# EAGLE design CY8C_TQFP_BreakOut (EAGLE 6.5.0)
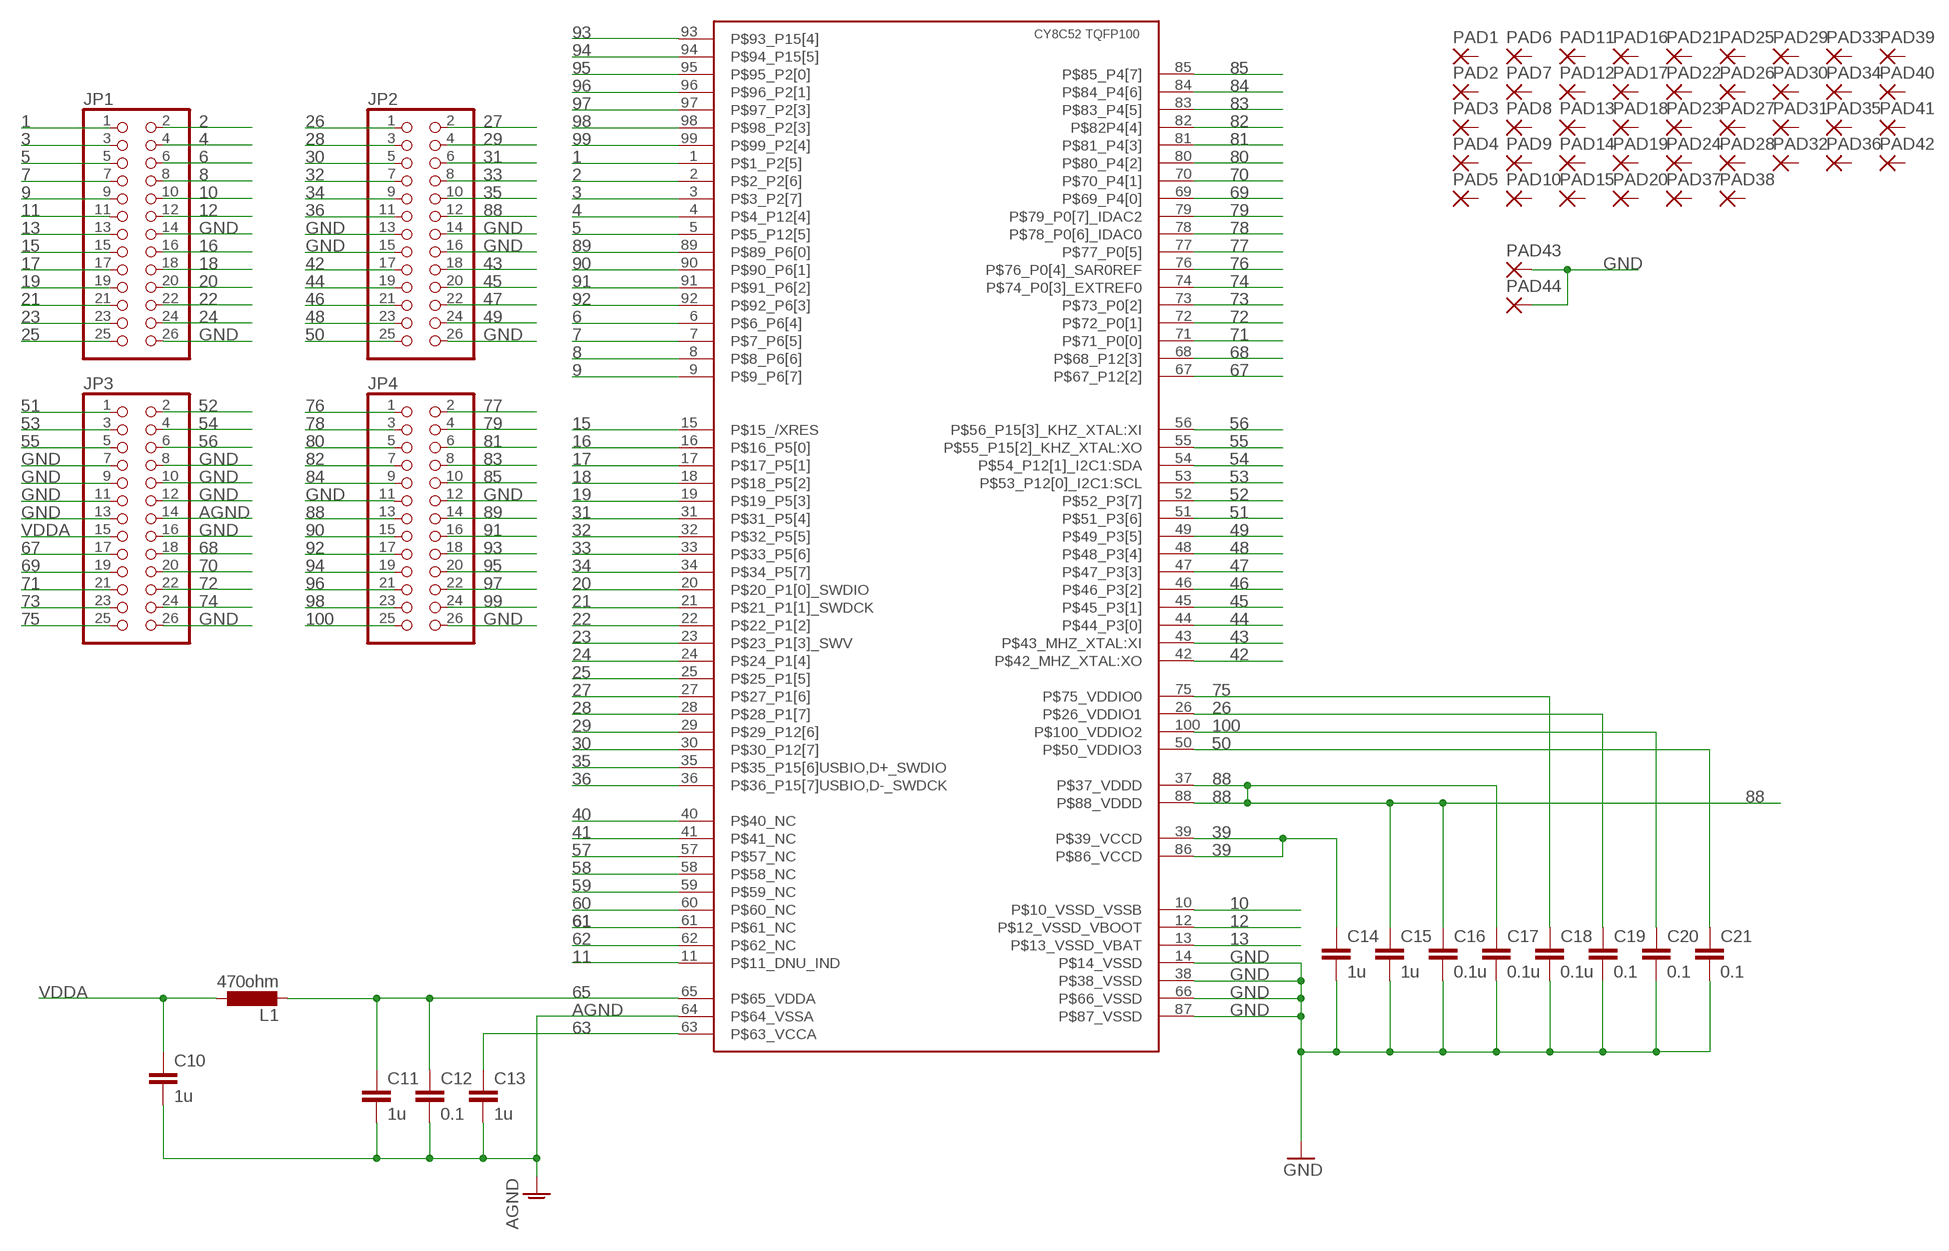
[diagram p0: schematic, sheet 1]

## Parts
C10  1u  C-EUC3216  [C3216]
C11  1u  C-EUC3216  [C3216]
C12  0.1  C-EUC2012  [C2012]
C13  1u  C-EUC2012  [C2012]
C14  1u  C-EUC3216  [C3216]
C15  1u  C-EUC3216  [C3216]
C16  0.1u  C-EUC2012  [C2012]
C17  0.1u  C-EUC2012  [C2012]
C18  0.1u  C-EUC2012  [C2012]
C19  0.1  C-EUC2012  [C2012]
C20  0.1  C-EUC2012  [C2012]
C21  0.1  C-EUC2012  [C2012]
IC1  PSOC5LP52XX_TQFP100  [TQFP100_MOD]
JP1  PINHD-2X13  [2X13]
JP2  PINHD-2X13  [2X13]
JP3  PINHD-2X13  [2X13]
JP4  PINHD-2X13  [2X13]
L1  470ohm  L-EUL3225M  [L3225M]
PAD1  SMD2  [SMD1,27-2,54]
PAD2  SMD2  [SMD1,27-2,54]
PAD3  SMD2  [SMD1,27-2,54]
PAD4  SMD2  [SMD1,27-2,54]
PAD5  SMD2  [SMD1,27-2,54]
PAD6  SMD2  [SMD1,27-2,54]
PAD7  SMD2  [SMD1,27-2,54]
PAD8  SMD2  [SMD1,27-2,54]
PAD9  SMD2  [SMD1,27-2,54]
PAD10  SMD2  [SMD1,27-2,54]
PAD11  SMD2  [SMD1,27-2,54]
PAD12  SMD2  [SMD1,27-2,54]
PAD13  SMD2  [SMD1,27-2,54]
PAD14  SMD2  [SMD1,27-2,54]
PAD15  SMD2  [SMD1,27-2,54]
PAD16  SMD2  [SMD1,27-2,54]
PAD17  SMD2  [SMD1,27-2,54]
PAD18  SMD2  [SMD1,27-2,54]
PAD19  SMD2  [SMD1,27-2,54]
PAD20  SMD2  [SMD1,27-2,54]
PAD21  SMD2  [SMD1,27-2,54]
PAD22  SMD2  [SMD1,27-2,54]
PAD23  SMD2  [SMD1,27-2,54]
PAD24  SMD2  [SMD1,27-2,54]
PAD25  SMD2  [SMD1,27-2,54]
PAD26  SMD2  [SMD1,27-2,54]
PAD27  SMD2  [SMD1,27-2,54]
PAD28  SMD2  [SMD1,27-2,54]
PAD29  SMD2  [SMD1,27-2,54]
PAD30  SMD2  [SMD1,27-2,54]
PAD31  SMD2  [SMD1,27-2,54]
PAD32  SMD2  [SMD1,27-2,54]
PAD33  SMD2  [SMD1,27-2,54]
PAD34  SMD2  [SMD1,27-2,54]
PAD35  SMD2  [SMD1,27-2,54]
PAD36  SMD2  [SMD1,27-2,54]
PAD37  SMD2  [SMD1,27-2,54]
PAD38  SMD2  [SMD1,27-2,54]
PAD39  SMD2  [SMD1,27-2,54]
PAD40  SMD2  [SMD1,27-2,54]
PAD41  SMD2  [SMD1,27-2,54]
PAD42  SMD2  [SMD1,27-2,54]
PAD43  SMD2  [SMD1,27-2,54]
PAD44  SMD2  [SMD1,27-2,54]

## Nets
1: IC1.1(P$1_P2[5]) JP1.1
2: IC1.2(P$2_P2[6]) JP1.2
3: IC1.3(P$3_P2[7]) JP1.3
4: IC1.4(P$4_P12[4]) JP1.4
5: IC1.5(P$5_P12[5]) JP1.5
6: IC1.6(P$6_P6[4]) JP1.6
7: IC1.7(P$7_P6[5]) JP1.7
8: IC1.8(P$8_P6[6]) JP1.8
9: IC1.9(P$9_P6[7]) JP1.9
10: IC1.10(P$10_VSSD_VSSB) JP1.10
11: IC1.11(P$11_DNU_IND) JP1.11
12: IC1.12(P$12_VSSD_VBOOT) JP1.12
13: IC1.13(P$13_VSSD_VBAT) JP1.13
15: IC1.15(P$15_/XRES) JP1.15
16: IC1.16(P$16_P5[0]) JP1.16
17: IC1.17(P$17_P5[1]) JP1.17
18: IC1.18(P$18_P5[2]) JP1.18
19: IC1.19(P$19_P5[3]) JP1.19
20: IC1.20(P$20_P1[0]_SWDIO) JP1.20
21: IC1.21(P$21_P1[1]_SWDCK) JP1.21
22: IC1.22(P$22_P1[2]) JP1.22
23: IC1.23(P$23_P1[3]_SWV) JP1.23
24: IC1.24(P$24_P1[4]) JP1.24
25: IC1.25(P$25_P1[5]) JP1.25
26: C19.1 IC1.26(P$26_VDDIO1) JP2.1
27: IC1.27(P$27_P1[6]) JP2.2
28: IC1.28(P$28_P1[7]) JP2.3
29: IC1.29(P$29_P12[6]) JP2.4
30: IC1.30(P$30_P12[7]) JP2.5
31: IC1.31(P$31_P5[4]) JP2.6
32: IC1.32(P$32_P5[5]) JP2.7
33: IC1.33(P$33_P5[6]) JP2.8
34: IC1.34(P$34_P5[7]) JP2.9
35: IC1.35(P$35_P15[6]USBIO,D+_SWDIO) JP2.10
36: IC1.36(P$36_P15[7]USBIO,D-_SWDCK) JP2.11
39: C14.1 IC1.39(P$39_VCCD) IC1.86(P$86_VCCD)
40: IC1.40(P$40_NC)
41: IC1.41(P$41_NC)
42: IC1.42(P$42_MHZ_XTAL:XO) JP2.17
43: IC1.43(P$43_MHZ_XTAL:XI) JP2.18
44: IC1.44(P$44_P3[0]) JP2.19
45: IC1.45(P$45_P3[1]) JP2.20
46: IC1.46(P$46_P3[2]) JP2.21
47: IC1.47(P$47_P3[3]) JP2.22
48: IC1.48(P$48_P3[4]) JP2.23
49: IC1.49(P$49_P3[5]) JP2.24
50: C21.1 IC1.50(P$50_VDDIO3) JP2.25
51: IC1.51(P$51_P3[6]) JP3.1
52: IC1.52(P$52_P3[7]) JP3.2
53: IC1.53(P$53_P12[0]_I2C1:SCL) JP3.3
54: IC1.54(P$54_P12[1]_I2C1:SDA) JP3.4
55: IC1.55(P$55_P15[2]_KHZ_XTAL:XO) JP3.5
56: IC1.56(P$56_P15[3]_KHZ_XTAL:XI) JP3.6
57: IC1.57(P$57_NC)
58: IC1.58(P$58_NC)
59: IC1.59(P$59_NC)
60: IC1.60(P$60_NC)
61: IC1.61(P$61_NC)
62: IC1.62(P$62_NC)
63: C13.1 IC1.63(P$63_VCCA)
65: C11.1 C12.1 IC1.65(P$65_VDDA) L1.2
67: IC1.67(P$67_P12[2]) JP3.17
68: IC1.68(P$68_P12[3]) JP3.18
69: IC1.69(P$69_P4[0]) JP3.19
70: IC1.70(P$70_P4[1]) JP3.20
71: IC1.71(P$71_P0[0]) JP3.21
72: IC1.72(P$72_P0[1]) JP3.22
73: IC1.73(P$73_P0[2]) JP3.23
74: IC1.74(P$74_P0[3]_EXTREF0) JP3.24
75: C18.1 IC1.75(P$75_VDDIO0) JP3.25
76: IC1.76(P$76_P0[4]_SAR0REF) JP4.1
77: IC1.77(P$77_P0[5]) JP4.2
78: IC1.78(P$78_P0[6]_IDAC0) JP4.3
79: IC1.79(P$79_P0[7]_IDAC2) JP4.4
80: IC1.80(P$80_P4[2]) JP4.5
81: IC1.81(P$81_P4[3]) JP4.6
82: IC1.82(P$82P4[4]) JP4.7
83: IC1.83(P$83_P4[5]) JP4.8
84: IC1.84(P$84_P4[6]) JP4.9
85: IC1.85(P$85_P4[7]) JP4.10
88: C15.1 C16.1 C17.1 IC1.37(P$37_VDDD) IC1.88(P$88_VDDD) JP2.12 JP4.13
89: IC1.89(P$89_P6[0]) JP4.14
90: IC1.90(P$90_P6[1]) JP4.15
91: IC1.91(P$91_P6[2]) JP4.16
92: IC1.92(P$92_P6[3]) JP4.17
93: IC1.93(P$93_P15[4]) JP4.18
94: IC1.94(P$94_P15[5]) JP4.19
95: IC1.95(P$95_P2[0]) JP4.20
96: IC1.96(P$96_P2[1]) JP4.21
97: IC1.97(P$97_P2[3]) JP4.22
98: IC1.98(P$98_P2[3]) JP4.23
99: IC1.99(P$99_P2[4]) JP4.24
100: C20.1 IC1.100(P$100_VDDIO2) JP4.25
AGND: C10.2 C11.2 C12.2 C13.2 IC1.64(P$64_VSSA) JP3.14
GND: C14.2 C15.2 C16.2 C17.2 C18.2 C19.2 C20.2 C21.2 IC1.14(P$14_VSSD) IC1.38(P$38_VSSD) IC1.66(P$66_VSSD) IC1.87(P$87_VSSD) JP1.14 JP1.26 JP2.13 JP2.14 JP2.15 JP2.16 JP2.26 JP3.7 JP3.8 JP3.9 JP3.10 JP3.11 JP3.12 JP3.13 JP3.16 JP3.26 JP4.11 JP4.12 JP4.26 PAD43.1(P) PAD44.1(P)
VDDA: C10.1 JP3.15 L1.1
Unconnected: PAD1.1(P) PAD2.1(P) PAD3.1(P) PAD4.1(P) PAD5.1(P) PAD6.1(P) PAD7.1(P) PAD8.1(P) PAD9.1(P) PAD10.1(P) PAD11.1(P) PAD12.1(P) PAD13.1(P) PAD14.1(P) PAD15.1(P) PAD16.1(P) PAD17.1(P) PAD18.1(P) PAD19.1(P) PAD20.1(P) PAD21.1(P) PAD22.1(P) PAD23.1(P) PAD24.1(P) PAD25.1(P) PAD26.1(P) PAD27.1(P) PAD28.1(P) PAD29.1(P) PAD30.1(P) PAD31.1(P) PAD32.1(P) PAD33.1(P) PAD34.1(P) PAD35.1(P) PAD36.1(P) PAD37.1(P) PAD38.1(P) PAD39.1(P) PAD40.1(P) PAD41.1(P) PAD42.1(P)

## Library data of the parts
C10-C21 = resistor:C-EU: CAPACITOR, European symbol
IC1 = PSoC5LP:PSOC5LP52XX_TQFP100
JP1-JP4 = pinhead:PINHD-2X13: PIN HEADER
L1 = resistor:L-EU: INDUCTOR, European symbol
PAD1-PAD44 = wirepad:SMD2: SMD PAD

## Board
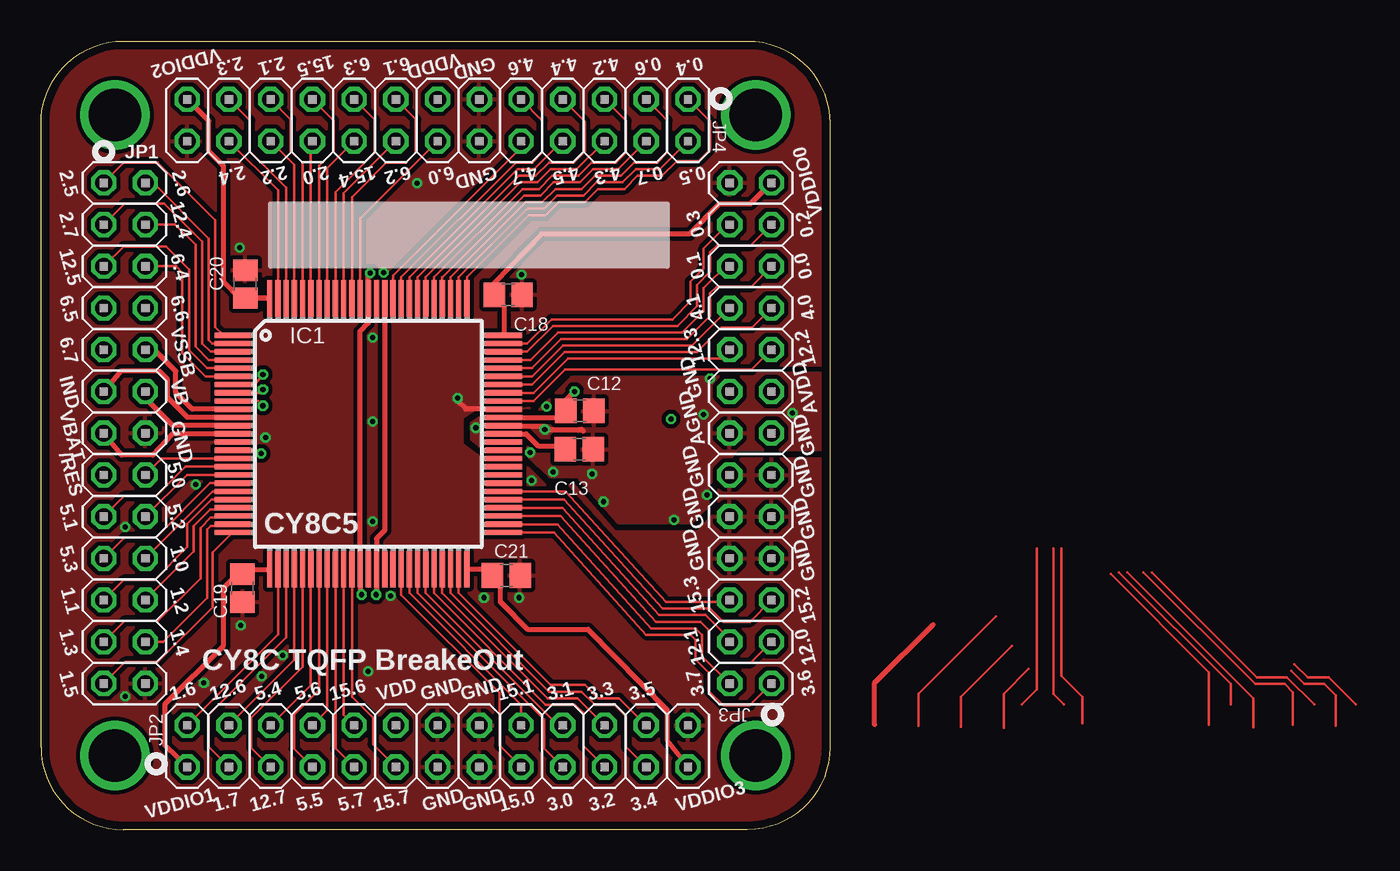
[diagram p1: board, top side]
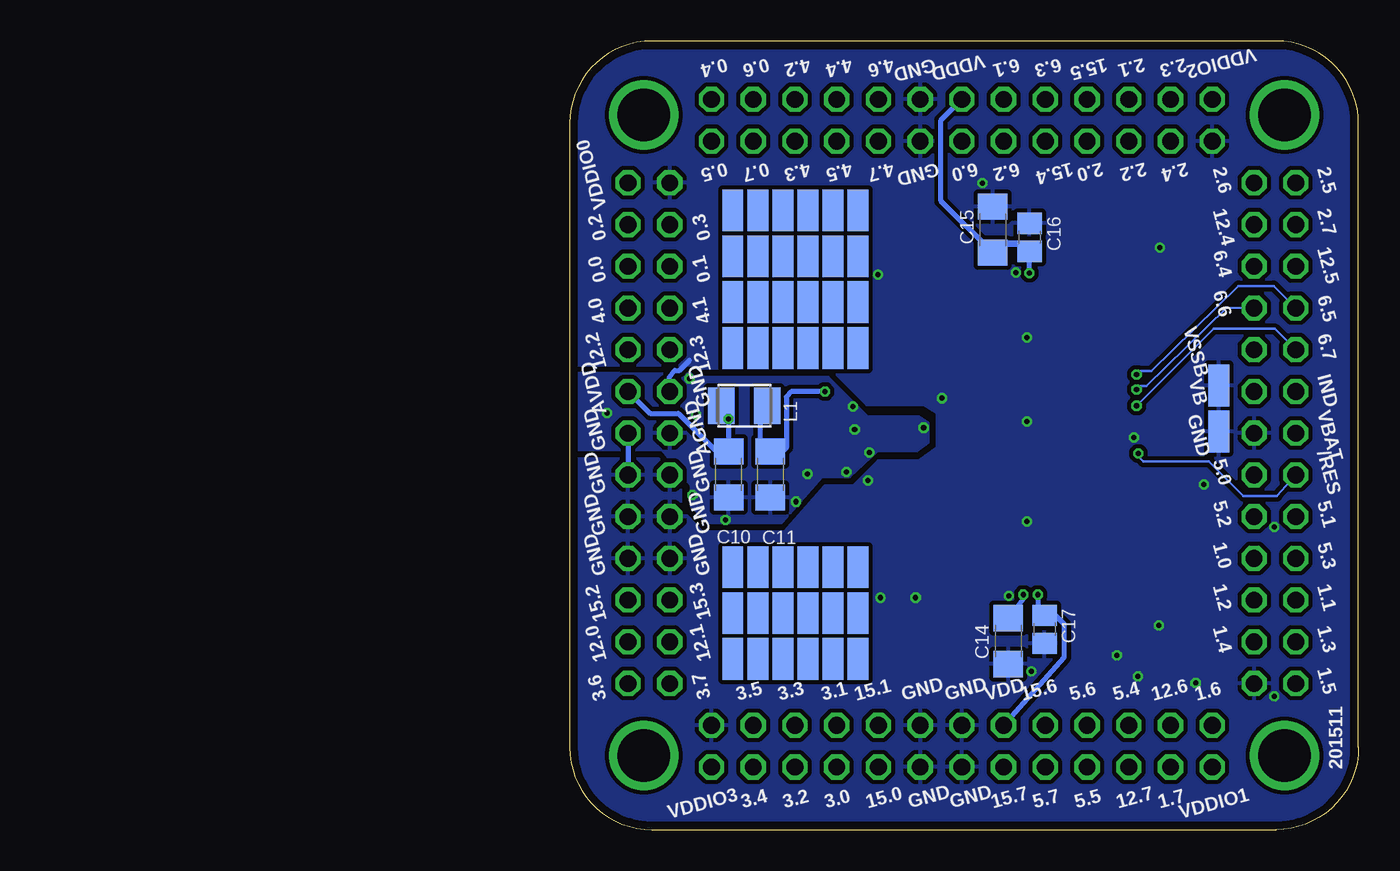
[diagram p2: board, bottom side, seen from below]

Size 48 x 48 mm. Coordinates in mm from the lower left corner, seen from the top.
Outline: 0,5 0,43 arc-90 5,48 43,48 arc-90 48,43 48,5 arc-90 43,0 5,0 arc-90 0,5
Copper layers (1*16): Top 0.035mm / dielectric 1.6mm / Bottom 0.035mm
Design rules "Elecrow_2-layer_PCB_eagle_rule": minimum track width 6mil, minimum drill 12mil, track to track 6mil, track to pad 6mil, pad to pad 6mil, via to via 8mil, smd to smd 0mil, copper to edge 20mil, drill to drill 10mil, minimum pad ring 6mil, minimum via ring 6mil, stop-mask expansion 0mil, vias tented up to drill 100mil, thermal gap 10mil

### Footprints (pad centres in the part's own frame; a part is rotated, then mirrored left to right if it is on the bottom)
C3216 = smd 1.6 x 1.8: 1 -1.4,0; 2 1.4,0
C2012 = smd 1.3 x 1.5: 1 -0.85,0; 2 0.85,0
TQFP100_MOD = smd 2.2 x 0.32: 1 -8.25,5.73; 2 -8.25,5.23; 3 -8.25,4.73; 4 -8.25,4.23; 5 -8.25,3.73; 6 -8.25,3.23; 7 -8.25,2.73; 8 -8.25,2.23; 9 -8.25,1.73; 10 -8.25,1.23; 11 -8.25,0.73; 12 -8.25,0.23; 13 -8.25,-0.27; 14 -8.25,-0.77; 15 -8.25,-1.27; 16 -8.25,-1.77; 17 -8.25,-2.27; 18 -8.25,-2.77; 19 -8.25,-3.27; 20 -8.25,-3.77; 21 -8.25,-4.27; 22 -8.25,-4.77; 23 -8.25,-5.27; 24 -8.25,-5.77; 25 -8.25,-6.27; 51 8.25,-6.27; 52 8.25,-5.77; 53 8.25,-5.27; 54 8.25,-4.77; 55 8.25,-4.27; 56 8.25,-3.77; 57 8.25,-3.27; 58 8.25,-2.77; 59 8.25,-2.27; 60 8.25,-1.77; 61 8.25,-1.27; 62 8.25,-0.77; 63 8.25,-0.27; 64 8.25,0.23; 65 8.25,0.73; 66 8.25,1.23; 67 8.25,1.73; 68 8.25,2.23; 69 8.25,2.73; 70 8.25,3.23; 71 8.25,3.73; 72 8.25,4.23; 73 8.25,4.73; 74 8.25,5.23; 75 8.25,5.73 | smd 0.32 x 2.2: 26 -6,-8.52; 27 -5.5,-8.52; 28 -5,-8.52; 29 -4.5,-8.52; 30 -4,-8.52; 31 -3.5,-8.52; 32 -3,-8.52; 33 -2.5,-8.52; 34 -2,-8.52; 35 -1.5,-8.52; 36 -1,-8.52; 37 -0.5,-8.52; 38 0,-8.52; 39 0.5,-8.52; 40 1,-8.52; 41 1.5,-8.52; 42 2,-8.52; 43 2.5,-8.52; 44 3,-8.52; 45 3.5,-8.52; 46 4,-8.52; 47 4.5,-8.52; 48 5,-8.52; 49 5.5,-8.52; 50 6,-8.52; 76 6,7.98; 77 5.5,7.98; 78 5,7.98; 79 4.5,7.98; 80 4,7.98; 81 3.5,7.98; 82 3,7.98; 83 2.5,7.98; 84 2,7.98; 85 1.5,7.98; 86 1,7.98; 87 0.5,7.98; 88 0,7.98; 89 -0.5,7.98; 90 -1,7.98; 91 -1.5,7.98; 92 -2,7.98; 93 -2.5,7.98; 94 -3,7.98; 95 -3.5,7.98; 96 -4,7.98; 97 -4.5,7.98; 98 -5,7.98; 99 -5.5,7.98; 100 -6,7.98
2X13 = drill 1.016 octagon: 1 -15.24,-1.27; 2 -15.24,1.27; 3 -12.7,-1.27; 4 -12.7,1.27; 5 -10.16,-1.27; 6 -10.16,1.27; 7 -7.62,-1.27; 8 -7.62,1.27; 9 -5.08,-1.27; 10 -5.08,1.27; 11 -2.54,-1.27; 12 -2.54,1.27; 13 0,-1.27; 14 0,1.27; 15 2.54,-1.27; 16 2.54,1.27; 17 5.08,-1.27; 18 5.08,1.27; 19 7.62,-1.27; 20 7.62,1.27; 21 10.16,-1.27; 22 10.16,1.27; 23 12.7,-1.27; 24 12.7,1.27; 25 15.24,-1.27; 26 15.24,1.27
L3225M = smd 1.6 x 2.2: 1 -1.4,0; 2 1.4,0
SMD1,27-2,54 = smd 1.27 x 2.54: 1 0,0

### Placement (x,y rotation side)
C10  38.33,21.62 270 bottom
C11  35.79,21.62 270 bottom
C12  32.79,25.49 0 top
C13  32.76,23.15 0 top
C14  21.31,11.47 270 bottom
C15  22.25,36.52 90 bottom
C16  20.02,36.06 90 bottom
C17  19.1,12.19 270 bottom
C18  28.43,32.55 0 top
C19  12.26,14.7 270 top
C20  12.43,33.2 90 top
C21  28.3,15.47 0 top
IC1  19.91,24.36 0 top
JP1  5.08,24.13 270 top
JP2  24.13,5.08 0 top
JP3  43.18,24.13 90 top
JP4  24.13,43.18 180 top
L1  37.37,25.8 0 bottom
PAD1  31.98,34.9 0 bottom
PAD2  35.03,34.9 0 bottom
PAD3  35.03,37.7 0 bottom
PAD4  33.5,37.7 0 bottom
PAD5  31.98,37.7 0 bottom
PAD6  33.5,32.11 0 bottom
PAD7  33.5,29.31 0 bottom
PAD8  31.98,32.11 0 bottom
PAD9  31.98,29.31 0 bottom
PAD10  33.5,34.9 0 bottom
PAD11  38.08,29.31 0 bottom
PAD12  36.55,37.7 0 bottom
PAD13  38.08,37.7 0 bottom
PAD14  38.08,34.9 0 bottom
PAD15  36.55,32.11 0 bottom
PAD16  38.08,32.11 0 bottom
PAD17  36.55,34.9 0 bottom
PAD18  35.03,29.31 0 bottom
PAD19  35.03,32.11 180 bottom
PAD20  36.55,29.31 0 bottom
PAD21  31.98,15.98 0 bottom
PAD22  33.5,15.98 0 bottom
PAD23  35.03,15.98 0 bottom
PAD24  36.55,15.98 0 bottom
PAD25  38.08,15.98 0 bottom
PAD26  31.98,13.18 0 bottom
PAD27  33.5,13.18 0 bottom
PAD28  35.03,13.18 0 bottom
PAD29  36.55,13.18 0 bottom
PAD30  38.08,13.18 0 bottom
PAD31  31.98,10.39 0 bottom
PAD32  33.5,10.39 0 bottom
PAD33  35.03,10.39 0 bottom
PAD34  36.55,10.39 0 bottom
PAD35  38.08,10.39 0 bottom
PAD36  30.46,10.39 0 bottom
PAD37  30.46,13.18 0 bottom
PAD38  30.46,15.98 0 bottom
PAD39  30.46,34.9 0 bottom
PAD40  30.46,37.7 0 bottom
PAD41  30.46,29.31 0 bottom
PAD42  30.46,32.11 0 bottom
PAD43  8.48,27.03 0 bottom
PAD44  8.48,24.23 0 bottom

### Tracks (layer width: path | path; a pad name or v marks a point on that pad's centre or on a via)
1
  Top 0.16: IC1.1 11.11,30.09 10.6,30.6 10.6,37.1 7.1,40.6 5.04,40.6 JP1.1
2
  Top 0.16: IC1.2 10.41,29.59 10.2,29.8 10.2,35.98 6.81,39.37 JP1.2
3
  Top 0.16: IC1.3 10.31,29.09 9.8,29.6 9.8,35.8 7.5,38.1 5.08,38.1 JP1.3
4
  Top 0.16: IC1.4 10.21,28.59 9.4,29.4 9.4,35.6 8.17,36.83 JP1.4
5
  Top 0.16: IC1.5 10.11,28.09 9,29.2 9,34.1 7.6,35.5 5.02,35.5 JP1.5
6
  Top 0.16: IC1.6 10.01,27.59 8.6,29 8.6,33.9 8.21,34.29 JP1.6
7  (via drill 0.31)
  Top 0.16: IC1.7 12.99,27.09 v13.5,27.7
  Bottom 0.16: v13.5,27.7 13.3,27.9 12.6,27.9 7.3,33.1 5.16,33.1 JP1.7
8  (via drill 0.31)
  Top 0.16: IC1.8 13.29,26.59 v13.5,26.8
  Bottom 0.16: v13.5,26.8 13.3,27 12.9,27 8.02,31.78 JP1.8
9  (via drill 0.31)
  Top 0.16: IC1.9 13.21,26.09 v13.5,25.8
  Bottom 0.16: JP1.9 5.1,30.5 8.8,30.5 v13.5,25.8
10
  Top 0.3: IC1.10 9.21,25.59 8.2,26.6 8.2,27.9
  Top 0.305: 8.2,27.9 6.89,29.21 JP1.10
11
  Top 0.3: IC1.11 8.91,25.09 7.7,26.3 7.7,27.4 7.2,27.9 4.84,27.9 JP1.11
12
  Top 0.3: IC1.12 8.01,24.59 6.58,26.02
  Top 0.305: 6.58,26.02 6.58,26.44 JP1.12
13
  Top 0.3: IC1.13 7.99,24.09 6.8,22.8 4.9,22.8 JP1.13
14
  Top 0.3: 50.73,6.38 50.73,8.92
  Top 0.305: 50.73,8.92 54.28,12.47
15  (via drill 0.31)
  Top 0.16: IC1.15 13.21,23.09 v13.4,22.9
  Bottom 0.16: v13.4,22.9 13.4,22.7 13.1,22.4 9.1,22.4 7,20.3 4.96,20.3 JP1.15
16
  Top 0.16: IC1.16 7.35,22.59 JP1.16
17
  Top 0.16: IC1.17 8.79,22.09 7,20.3 5.06,20.3 JP1.17
18
  Top 0.16: IC1.18 8.89,21.59 JP1.18
19
  Top 0.16: JP1.19 5.1,17.8 7,17.8 10.29,21.09 IC1.19
20
  Top 0.16: IC1.20 10.43,20.59 JP1.20
21
  Top 0.16: IC1.21 10.39,20.09 8.9,18.6 8.9,17.2 6.9,15.2 5.04,15.2 JP1.21
22
  Top 0.16: IC1.22 11.57,19.5 10.3,19.5 9.3,18.5 9.3,16.92 JP1.22 6.7,14.2
23
  Top 0.16: IC1.23 11.57,19 10.34,19 9.7,18.36 9.7,15.3 7.1,12.7 5.08,12.7 JP1.23
24
  Top 0.16: IC1.24 11.57,18.5 10.34,18.5 10.1,18.27 10.1,14.1 7.43,11.43 JP1.24
25
  Top 0.16: IC1.25 10.44,16.86 10.44,13.54 7.1,10.2 5.12,10.2 JP1.25
26
  Top 0.3: JP2.1 7.55,5.11 7.55,7.65
  Top 0.305: 7.55,7.65 11.1,11.2 11.1,14.7 11.95,15.55 C19.1 12.74,15.84 IC1.26
27
  Top 0.16: IC1.27 14.41,11.88 JP2.2
28
  Top 0.16: IC1.28 14.91,11.71 10.2,7 10.2,5.04 JP2.3
29
  Top 0.16: IC1.29 15.41,10.34 JP2.4
30
  Top 0.16: IC1.30 15.91,9.91 12.8,6.8 12.8,4.98 JP2.5
31
  Top 0.16: IC1.31 16.41,8.79 JP2.6
32
  Top 0.16: IC1.32 16.91,8.52 15.4,7 15.4,4.92 JP2.7
33
  Top 0.16: IC1.33 17.41,7.25 JP2.8
34
  Top 0.16: IC1.34 17.91,4.95 JP2.9
35
  Top 0.16: IC1.35 18.41,6.99 JP2.10
36
  Top 0.16: IC1.36 18.91,8.09 20.2,6.8 20.2,5.2 JP2.11
37
  Top 0.16: 65.09,15.57 71.08,9.59 71.08,6.39
38
  Top 0.16: 65.59,15.67 72.39,8.88 72.39,7.62
39  (via drill 0.31)
  Top 0.305: IC1.86 20.91,18.22 20.41,17.72 IC1.39 20.41,14.31 v20.4,14.3
  Bottom 0.305: v20.4,14.3 20.4,14.04 C14.1
42
  Top 0.16: IC1.42 21.91,14.3 27.9,8.31 27.9,5.12 JP2.17
43
  Top 0.16: IC1.43 22.41,14.4 29.21,7.61 JP2.18
44
  Top 0.16: IC1.44 22.91,14.4 30.6,6.71 30.6,4.96 JP2.19
45
  Top 0.16: IC1.45 23.41,14.4 31.46,6.35 JP2.20
46
  Top 0.16: IC1.46 23.91,14.4 30.71,7.6 32.5,7.6 33,7.1 33,5.1 JP2.21
47
  Top 0.16: IC1.47 24.41,14.4 30.82,8 32.64,8 JP2.22
48
  Top 0.16: IC1.48 24.91,14.4 30.91,8.4 32.9,8.4 33.7,7.6 34.9,7.6 35.6,6.9 35.6,5.04 JP2.23
49
  Top 0.16: IC1.49 25.41,14.4 31.02,8.8 33.1,8.8 33.9,8 35.18,8 JP2.24
50
  Top 0.305: IC1.50 27.09,15.84 C21.1 27.55,15.47 27.95,15.06 27.95,13.86 29.61,12.2 33.3,12.2 38.1,7.3 38.1,5.44 JP2.25
51
  Top 0.16: JP3.1 43.12,7.56 41.52,7.56 40.62,8.46 40.62,9.56 39.82,10.36 39.82,11.56 39.52,11.86 36.82,11.86 31.23,18.09 IC1.51
52
  Top 0.16: IC1.52 31.43,18.59 37.12,12.26 39.82,12.26 40.22,11.86 40.22,10.56 41.86,8.92 JP3.2
53
  Top 0.16: JP3.3 43.18,10.16 41.32,10.16 40.62,10.86 40.62,12.16 40.12,12.66 37.42,12.66 31.62,19.09 IC1.53
54
  Top 0.16: IC1.54 31.73,19.59 37.62,13.06 40.42,13.06 41.82,11.66 JP3.4
55
  Top 0.16: JP3.5 43.14,12.66 41.52,12.66 40.72,13.46 37.82,13.46 31.82,20.09 IC1.55
56
  Top 0.16: JP3.6 41.8,13.86 38.02,13.86 31.93,20.59 IC1.56
63
  Top 0.305: IC1.63 29.52,24.09 30.25,23.36 31.7,23.36 C13.1
64
  Top 0.16: 76.28,10.07 77.08,9.27 78.36,9.27 80.01,7.62
65  (via drill 0.31)
  Top 0.16: 31.54,25.09 C12.1
  Top 0.305: IC1.65 31.54,25.09 | v32.45,26.66 31.94,26.14 C12.1
  Bottom 0.16: L1.2 35.56,25.62 | 35.78,22.96 C11.1
  Bottom 0.305: v32.45,26.66 34.52,26.66 34.82,26.36 34.82,23.26 35.12,22.96 35.78,22.96 | 35.56,25.62 36.42,24.76 36.42,23.6 C11.1
66
  Top 0.16: 76.08,9.67 76.88,8.87 78.08,8.87 78.78,8.17 78.78,6.31
67
  Top 0.16: IC1.67 29.98,26.09 31.89,28 43.24,28 JP3.17
68
  Top 0.16: IC1.68 29.98,26.59 32.05,28.66 41.36,28.66 JP3.18
69
  Top 0.16: IC1.69 29.89,27.09 31.86,29.06 39.92,29.06 41.42,30.56 43.26,30.56 JP3.19
70
  Top 0.16: IC1.70 29.89,27.59 31.75,29.46 39.62,29.46 JP3.20
71
  Top 0.16: IC1.71 29.89,28.09 31.66,29.86 39.32,29.86 40.72,31.26 40.72,32.66 41.12,33.06 43.22,33.06 JP3.21
72
  Top 0.16: IC1.72 29.79,28.59 31.45,30.26 39.02,30.26 40.32,31.56 40.32,32.96 41.88,34.52 JP3.22
73
  Top 0.16: IC1.73 29.59,29.09 31.16,30.66 38.72,30.66 39.92,31.86 39.92,33.16 40.72,33.96 40.72,35.16 41.12,35.56 43.18,35.56 JP3.23
74
  Top 0.16: IC1.74 29.59,29.59 31.05,31.06 38.42,31.06 39.52,32.16 39.52,33.36 40.32,34.16 40.32,35.36 42.02,37.06 JP3.24
75
  Top 0.16: 28.16,31.88 27.92,32.05 | 27.92,32.05 C18.1 | 27.25,33.06 27.25,32.71 27.92,32.05
  Top 0.305: C18.1 27.57,33.28 30.45,36.26 39.46,36.26 41.3,38.1 43.18,38.1 JP3.25 | 28.16,31.88 IC1.75
76
  Top 0.16: IC1.76 25.91,33.62 29.7,37.4 30.7,37.4 31.5,38.2 33.1,38.2 33.9,39 35.5,39 36.3,39.8 37.8,39.8 38.7,40.7 40,40.7 40.7,41.4 40.7,43.12 JP4.1
77
  Top 0.16: IC1.77 25.41,33.62 25.42,33.62 29.6,37.8 30.6,37.8 31.4,38.6 33,38.6 33.8,39.4 35.4,39.4 36.2,40.2 37.66,40.2 JP4.2
78
  Top 0.16: IC1.78 24.91,33.62 29.5,38.2 30.5,38.2 31.3,39 32.9,39 33.7,39.8 35.3,39.8 36.1,40.6 37.5,40.6 38.1,41.2 38.1,43.18 JP4.3
79
  Top 0.16: IC1.79 24.41,33.62 24.42,33.62 29.4,38.6 30.4,38.6 31.2,39.4 32.8,39.4 33.6,40.2 35.12,40.2 JP4.4
80
  Top 0.16: IC1.80 23.91,33.62 29.3,39 30.3,39 31.1,39.8 32.7,39.8 33.5,40.6 35,40.6 35.6,41.2 35.6,43.14 JP4.5
81
  Top 0.16: IC1.81 23.41,33.62 29.2,39.4 30.2,39.4 31,40.2 32.6,40.2 34.29,41.89 JP4.6 34.52,42.12
82
  Top 0.16: IC1.82 22.91,33.62 29.09,39.8 30.1,39.8 30.9,40.6 32.4,40.6 33.1,41.3 33.1,43.1 JP4.7
83
  Top 0.16: IC1.83 22.41,33.62 29,40.2 30,40.2 31.71,41.91 JP4.8
84
  Top 0.16: IC1.84 21.91,33.62 28.89,40.6 29.9,40.6 30.5,41.2 30.5,43.16 JP4.9
85
  Top 0.16: IC1.85 21.41,33.72 29.44,41.74 JP4.10
86
  Top 0.16: 67.59,15.67 74,9.27 75.82,9.27 77.47,7.62
87
  Top 0.16: 67.09,15.67 73.89,8.87 75.68,8.87 76.18,8.37 76.18,6.37
88  (via drill 0.31)
  Top 0.305: v20.02,33.88 19.91,33.77 IC1.88 19.91,30.82 19.41,30.32 IC1.37 19.41,14.48 v19.5,14.3
  Bottom 0.152: 19.91,35.79 C16.1 | 22.86,35.56 C15.1
  Bottom 0.305: 19.95,35.22 C16.1 | 21.9,35.66 22.25,35.3 C15.1 25.4,38.27 25.4,43.18 JP4.13 | v20.02,33.88 20.02,35.14 20.42,35.54 | v19.5,14.3 19.5,13.54 C17.1 18.96,13 18.4,13 17.9,12.5 17.9,10.5 JP2.12
  Bottom 0.406: 21.9,35.66 20.57,35.66 20.42,35.54 C16.1
89
  Top 0.16: IC1.89 19.41,37.2 JP4.14
90
  Top 0.16: IC1.90 18.91,38.52 21,40.6 22.2,40.6 22.8,41.2 22.8,43.24 JP4.15
91
  Top 0.16: IC1.91 18.41,38.73 JP4.16
92
  Top 0.16: IC1.92 17.91,38.81 20.3,41.2 20.3,43.2 JP4.17
93
  Top 0.16: IC1.93 17.41,40.27 JP4.18
94
  Top 0.16: IC1.94 16.91,40.41 17.8,41.3 17.8,43.16 JP4.19
95
  Top 0.16: IC1.95 16.41,41.81 JP4.20
96
  Top 0.16: IC1.96 15.91,40.59 15.2,41.3 15.2,43.22 JP4.21
97
  Top 0.16: IC1.97 15.41,40.47 JP4.22
98
  Top 0.16: IC1.98 14.91,39.09 12.7,41.3 12.7,43.18 JP4.23
99
  Top 0.16: IC1.99 14.41,38.92 JP4.24
100
  Top 0.305: C20.1 13.9,32.35 IC1.100 12.11,32.34 11.1,33.35 11.1,40.4 10.2,41.3 10.2,43.14 JP4.25
101
  Top 0.16: 66.09,15.67 73.78,7.99 73.78,6.23
102
  Top 0.16: 60.09,9.79 58.58,8.27 58.58,6.19
103
  Top 0.16: 60.59,17.11 60.59,8.53 59.69,7.62
104
  Top 0.16: 58.09,12.98 53.38,8.27 53.38,6.31
105
  Top 0.16: 59.09,11.19 55.98,8.07 55.98,6.25
106
  Top 0.16: 61.59,17.11 61.59,8.26 62.23,7.62
107
  Top 0.16: 62.09,17.11 62.09,9.36 63.38,8.07 63.38,6.47
AGND  (via drill 0.31)
  Top 0.16: IC1.64 28.2,24.56 | C13.2 33.13,23.15
  Top 0.305: 28.2,24.56 30.66,24.56 30.86,24.36 32.91,24.36 33.01,24.26
  Top 0.813: JP3.14 42.14,24.28 | 33.41,23.18 C13.2
  Bottom 0.813: C10.2 38.33,19.97
  other vias: 26.45,24.46 30.75,25.76 29.75,22.96 31.16,21.76 30.66,24.36 40.72,27.46 40.32,25.26 38.52,18.86 34.22,19.96 33.52,21.66 40.52,20.36 45.72,25.36
  pour Top (isolate 0.254): 48,23.1 48,27.8 45,27.8 40.62,27.76 40.42,27.56 32.26,27.56 29.86,25.16 26.75,25.16 26.16,24.76 26.16,23.76 27.05,23.06 29.25,23.06 30.95,21.46 32.66,21.46 35.12,18.66 39.62,18.66 40.62,19.66 40.62,20.96 42.39,23.1
  pour Bottom (isolate 0.254): 48,27.8 45,27.8 40.62,27.76 40.42,27.56 32.26,27.56 29.86,25.16 26.75,25.16 26.16,24.76 26.16,23.56 26.86,23.06 29.25,23.06 30.95,21.46 32.66,21.46 35.12,18.66 39.62,18.66 40.62,19.66 40.62,20.96 42.39,23.1 48,23.1
GND  (via drill 0.3, 0.31)
  Top 0.305: IC1.66 25.86,25.59 25.36,26.09 v25.36,26.26
  Bottom 0.305: v25.36,26.26 25.36,26.46 | JP3.16 41.94,27.54 41.62,27.96 41.32,27.96 40.72,28.56 | JP3.13 JP3.11
  other vias: 22.89,39.35 20.18,18.75 9.91,8.92 29.25,33.79 19.91,9.62 5.11,8.12 26.95,14.12 29.86,21.26 13.65,23.86 20.18,29.95 20.85,33.91 20.18,24.85 12.14,12.42 13.41,9.32 14.71,10.62 5.11,18.42 9.41,21.02 12.09,35.42 29.09,14.12 21.29,14.22
  pour Bottom (isolate 0.254): 43,48 5,48 arc90 0,43 0,5 arc90 5,0 43,0 arc90 48,5 48,22.6 42.6,22.6 41.22,20.96 41.22,19.56 39.92,18.16 34.92,18.16 32.45,20.96 30.75,20.96 29.25,22.46 26.75,22.46 25.66,23.26 25.66,25.36 26.45,25.86 29.95,25.86 32.16,28.06 40.22,28.06 40.42,28.26 48,28.26 48,43 arc90
  pour Top (isolate 0.254): 43,48 5,48 arc90 0,43 0,5 arc90 5,0 43,0 arc90 48,5 48,22.6 42.6,22.6 41.22,20.96 41.22,19.56 39.92,18.16 34.92,18.16 32.45,20.96 30.75,20.96 29.16,22.56 26.86,22.56 25.66,23.46 25.66,25.06 26.55,25.66 29.75,25.66 32.16,28.06 40.22,28.06 40.42,28.26 48,28.26 48,43 arc90
N$1  (via drill 3.2)
  other vias: 4.5,4.5
N$2  (via drill 3.2)
  other vias: 43.5,4.5
N$3  (via drill 3.2)
  other vias: 43.5,43.5
N$4  (via drill 3.2)
  other vias: 4.5,43.5
VDDA  (via drill 0.31)
  Bottom 0.16: 38.34,22.96 C10.1
  Bottom 0.305: JP3.15 43.11,25.33 41.39,25.33 39.02,22.96 38.34,22.96 | L1.1 v38.33,25 C10.1

### Text on the board
tPlace: VDDIO2 | 2.3 | 2.1 | 15.5 | 6.3 | 6.1 | VDDD | GND | 4.6 | 4.4 | 4.2 | 0.6 | 0.4 | 2.5 | 2.6 | 2.4 | 2.2 | 2.0 | 15.4 | 6.2 | 6.0 | GND | 4.7 | 4.5 | 4.3 | 0.7 | 0.5 | 12.4 | 2.7 | VDDIO0 | 0.3 | 0.2 | 12.5 | 6.4 | 0.1 | 0.0 | 6.5 | 6.6 | 4.1 | 4.0 | 6.7 | VSSB | IND | 12.3 | 12.2 | VB | GND | VBAT | GND | AVDD | /RES | AGND | GND | 5.0 | GND | 5.1 | 5.2 | GND | CY8C5 | GND | GND | 5.3 | 1.0 | GND | 1.1 | 1.2 | GND | 15.3 | 15.2 | 1.3 | 1.4 | 1.5 | 12.1 | 12.0 | 1.6 | 12.6 | 5.4 | 5.6 | 15.6 | VDD | GND | GND | 15.1 | 3.1 | 3.3 | 3.5 | 3.7 | 3.6 | VDDIO1 | 1.7 | 12.7 | 5.5 | 5.7 | 15.7 | GND | GND | 15.0 | 3.0 | 3.2 | 3.4 | VDDIO3
bPlace: VDDIO2 | 2.3 | 2.1 | 15.5 | 6.3 | 6.1 | VDDD | GND | 4.6 | 4.4 | 4.2 | 0.6 | 0.4 | 2.4 | 2.2 | 2.0 | 15.4 | 6.2 | 6.0 | GND | 4.7 | 4.5 | 4.3 | 0.7 | 0.5 | 2.5 | 2.6 | 2.7 | 12.4 | VDDIO0 | 0.3 | 0.2 | 12.5 | 6.4 | 6.6 | 0.1 | 0.0 | 6.5 | 4.1 | 4.0 | 6.7 | VSSB | IND | 12.3 | 12.2 | VB | GND | VBAT | GND | AVDD | /RES | AGND | GND | 5.0 | GND | GND | 5.1 | 5.2 | GND | GND | 5.3 | 1.0 | GND | GND | 1.1 | 1.2 | 15.3 | 15.2 | 1.3 | 1.4 | 1.5 | 12.1 | 12.0 | 1.6 | 12.6 | 5.4 | 5.6 | 15.6 | VDD | GND | GND | 15.1 | 3.1 | 3.3 | 3.5 | 3.7 | 3.6 | VDDIO1 | 1.7 | 12.7 | 5.5 | 5.7 | 15.7 | GND | GND | 15.0 | 3.0 | 3.2 | 3.4 | VDDIO3
tNames: CY8C TQFP BreakeOut
bNames: 201511